# EAGLE design rgbshade-monocle-r1 (EAGLE 5.12)
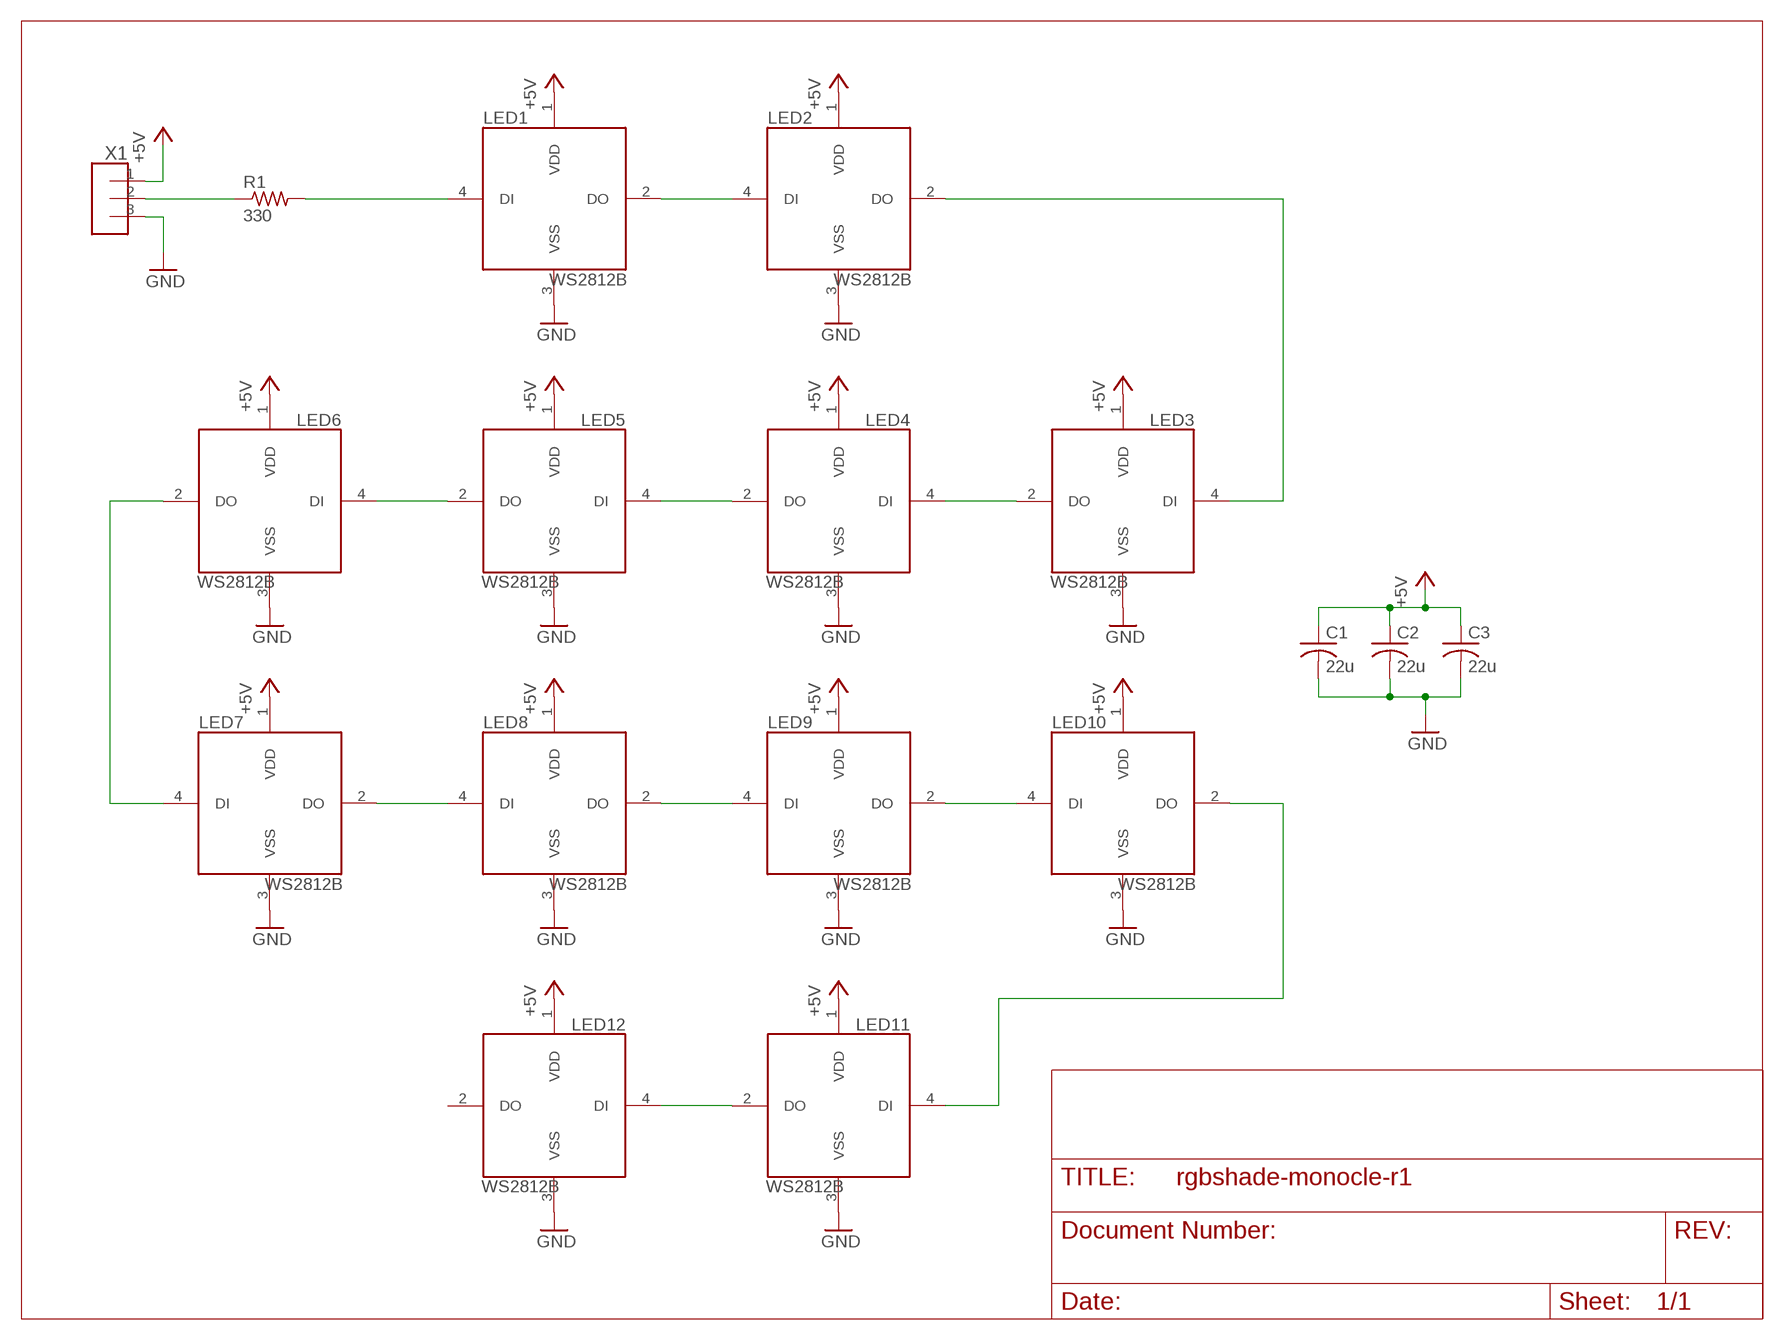
[diagram p0: schematic, sheet 1]

## Parts
C1  22u  C-USC1206  [C1206]
C2  22u  C-USC1206  [C1206]
C3  22u  C-USC1206  [C1206]
LED1  WS2812B  [LED-TRICOLOR-5050-4PIN]
LED2  WS2812B  [LED-TRICOLOR-5050-4PIN]
LED3  WS2812B  [LED-TRICOLOR-5050-4PIN]
LED4  WS2812B  [LED-TRICOLOR-5050-4PIN]
LED5  WS2812B  [LED-TRICOLOR-5050-4PIN]
LED6  WS2812B  [LED-TRICOLOR-5050-4PIN]
LED7  WS2812B  [LED-TRICOLOR-5050-4PIN]
LED8  WS2812B  [LED-TRICOLOR-5050-4PIN]
LED9  WS2812B  [LED-TRICOLOR-5050-4PIN]
LED10  WS2812B  [LED-TRICOLOR-5050-4PIN]
LED11  WS2812B  [LED-TRICOLOR-5050-4PIN]
LED12  WS2812B  [LED-TRICOLOR-5050-4PIN]
R1  330  R-US_R0603  [R0603]
X1  M03-100MIL  [100MIL-3]

## Nets
+5V: C1.1 C2.1 C3.1 LED1.1(VDD) LED2.1(VDD) LED3.1(VDD) LED4.1(VDD) LED5.1(VDD) LED6.1(VDD) LED7.1(VDD) LED8.1(VDD) LED9.1(VDD) LED10.1(VDD) LED11.1(VDD) LED12.1(VDD) X1.1
GND: C1.2 C2.2 C3.2 LED1.3(VSS) LED2.3(VSS) LED3.3(VSS) LED4.3(VSS) LED5.3(VSS) LED6.3(VSS) LED7.3(VSS) LED8.3(VSS) LED9.3(VSS) LED10.3(VSS) LED11.3(VSS) LED12.3(VSS) X1.3
N$1: LED1.2(DO) LED2.4(DI)
N$2: LED2.2(DO) LED3.4(DI)
N$3: LED3.2(DO) LED4.4(DI)
N$4: LED4.2(DO) LED5.4(DI)
N$5: LED5.2(DO) LED6.4(DI)
N$6: LED6.2(DO) LED7.4(DI)
N$7: LED7.2(DO) LED8.4(DI)
N$8: LED8.2(DO) LED9.4(DI)
N$9: LED9.2(DO) LED10.4(DI)
N$10: LED10.2(DO) LED11.4(DI)
N$11: LED11.2(DO) LED12.4(DI)
N$12: LED1.4(DI) R1.2
N$13: R1.1 X1.2
Unconnected: LED12.2(DO)

## Library data of the parts
C1-C3 = rcl:C-US: CAPACITOR, American symbol
LED1-LED12 = rbg-worldsemi-led:WS2812B
R1 = rcl:R-US_: RESISTOR, American symbol
X1 = rbg-generic-headers:M03-100MIL

## Board
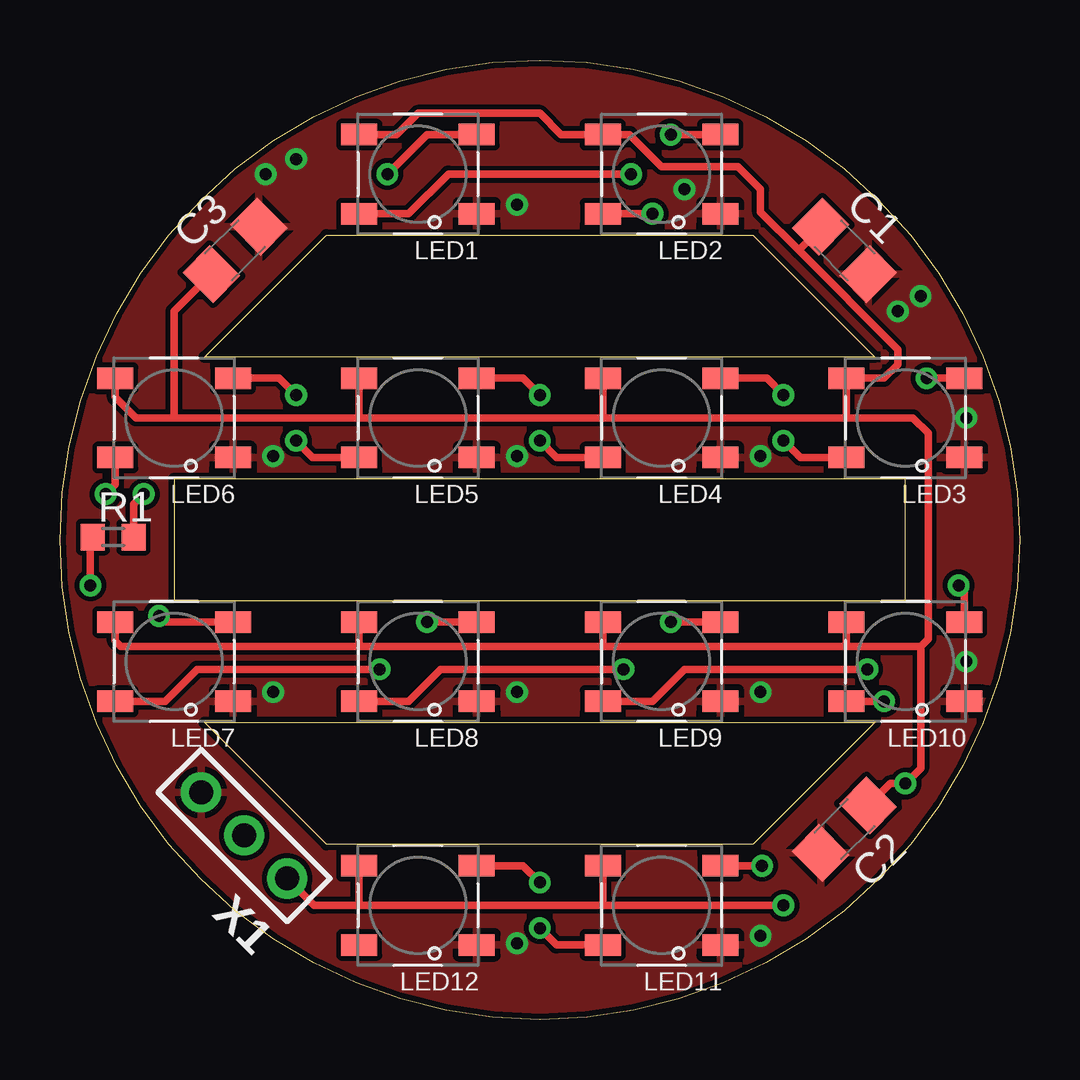
[diagram p1: board, top side]
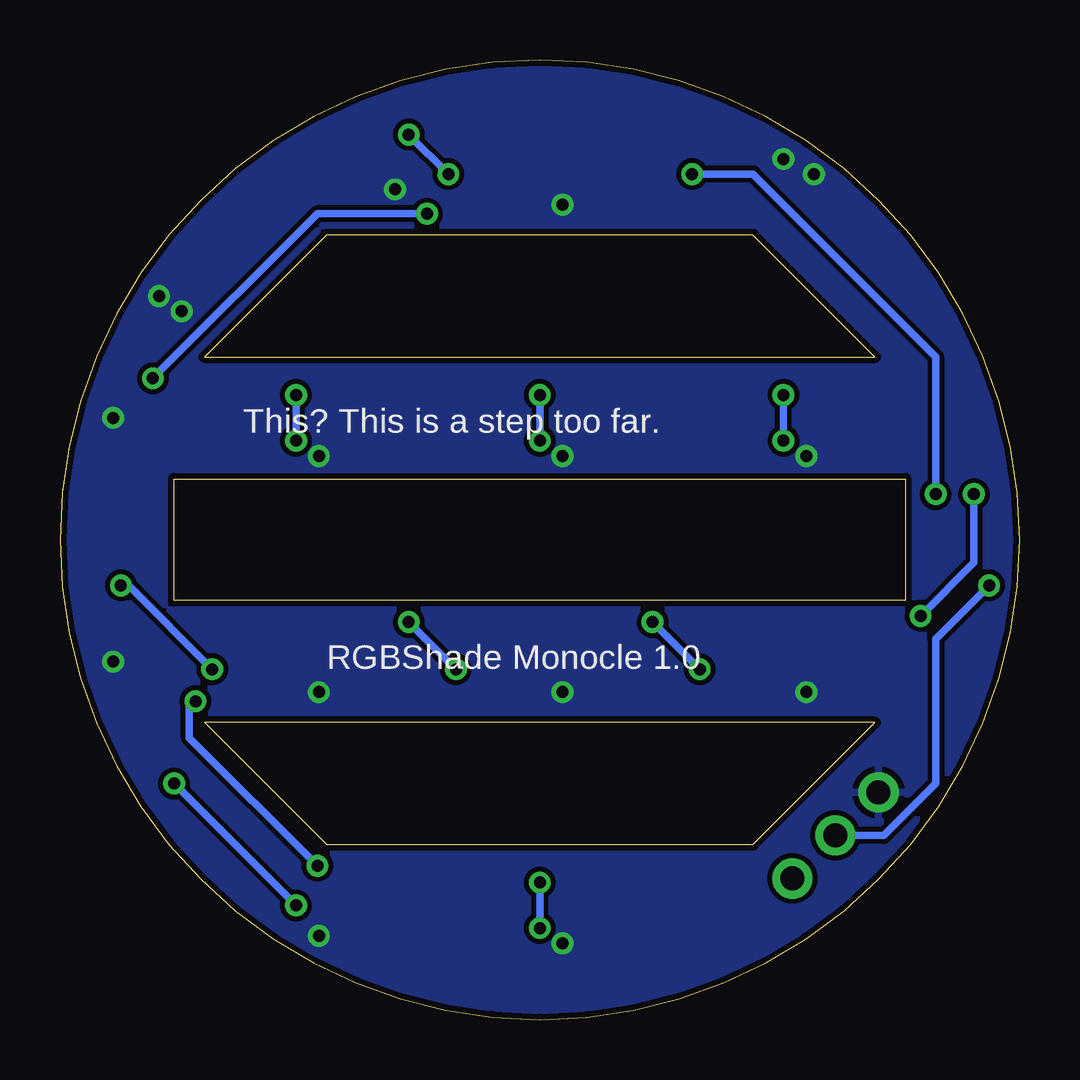
[diagram p2: board, bottom side, seen from below]

Size 40 x 40 mm. Coordinates in mm from the lower left corner, seen from the top.
Outline: 0,20 arc-180 40,20 arc-180 0,20
Outline: 6.03,12.38 33.97,12.38 28.89,7.3 11.11,7.3 6.03,12.38
Outline: 4.76,17.46 35.24,17.46 35.24,22.54 4.76,22.54 4.76,17.46
Outline: 11.11,32.7 28.89,32.7 33.97,27.62 6.03,27.62 11.11,32.7
Copper layers (1*16): Top 0.035mm / dielectric 1.5mm / Bottom 0.035mm
Design rules "default *": minimum track width 10mil, minimum drill 0.5mm, track to track 8mil, track to pad 8mil, pad to pad 8mil, via to via 8mil, smd to smd 8mil, copper to edge 10mil, drill to drill 8mil, minimum pad ring 10mil, minimum via ring 8mil, stop-mask expansion 4mil, vias tented up to drill 20mil, thermal gap 10mil

### Footprints (pad centres in the part's own frame; a part is rotated, then mirrored left to right if it is on the bottom)
C1206 = smd 1.6 x 1.8: 1 -1.4,0; 2 1.4,0
LED-TRICOLOR-5050-4PIN = smd 1.5 x 0.9: 1 2.45,-1.65; 2 2.45,1.65; 3 -2.45,1.65; 4 -2.45,-1.65
R0603 = smd 1 x 1.1: 1 -0.85,0; 2 0.85,0
100MIL-3 = drill 1 pad 1.676 round: 1 -2.54,0; 2 0,0; 3 2.54,0

### Placement (x,y rotation side)
C1  32.7,32.06 315 top
C2  32.7,7.94 225 top
C3  7.3,32.06 45 top
LED1  14.92,35.24 180 top
LED2  25.08,35.24 180 top
LED3  35.24,25.08 180 top
LED4  25.08,25.08 180 top
LED5  14.92,25.08 180 top
LED6  4.76,25.08 180 top
LED7  4.76,14.92 180 top
LED8  14.92,14.92 180 top
LED9  25.08,14.92 180 top
LED10  35.24,14.92 180 top
LED11  25.08,4.76 180 top
LED12  14.92,4.76 180 top
R1  2.22,20.11 0 top
X1  7.67,7.67 135 top

### Tracks (layer width: path | path; a pad name or v marks a point on that pad's centre or on a via)
+5V  (via drill 0.5)
  Top 0.305: 30.8,32.06 34.92,27.94 34.92,27.3 34.35,26.73 LED3.1 32.79,25.17 32.7,25.08 | 30.8,32.06 29.21,33.65 29.21,34.61 28.26,35.56 25.08,35.56 23.75,36.89 LED2.1 20.89,36.89 20,37.78 14.92,37.78 14.03,36.89 LED1.1 | 12.38,25.08 4.76,25.08 | 4.76,25.08 3.17,25.08 2.31,25.94 LED6.1 | 22.54,25.08 12.38,25.08 | LED5.1 12.47,25.17 12.38,25.08 | LED4.1 22.63,25.17 22.54,25.08 | C3.1 4.76,29.52 4.76,25.08 | LED7.1 2.31,15.78 2.54,15.55 12.38,15.55 | 32.7,15.55 35.88,15.55 | 22.54,15.55 32.7,15.55 | 22.54,15.55 12.38,15.55 | LED10.1 32.79,15.64 32.7,15.55 | LED9.1 22.63,15.64 22.54,15.55 | LED8.1 12.47,15.64 12.38,15.55 | 32.7,25.08 35.56,25.08 36.19,24.45 36.19,15.87 35.88,15.55 | 32.7,25.08 22.54,25.08 | LED12.1 12.47,4.85 12.38,4.76 | v30.16,4.76 22.54,4.76 | 22.54,4.76 12.38,4.76 | LED11.1 22.63,4.85 22.54,4.76 | 33.69,8.29 C2.1 34.61,9.84 v35.24,9.84 35.88,10.47 35.88,15.55 | X1.1 10.58,4.76 12.38,4.76 | C1.1 31.71,32.98 30.8,32.06
  Bottom 0.305: v35.24,9.84 | v35.24,9.84 v30.16,4.76
GND  (via drill 0.5)
  other vias: 19.05,23.49 29.21,23.49 8.89,23.49 19.05,33.97 26.03,34.61 19.05,13.65 8.89,13.65 29.21,13.65 19.05,3.17 29.21,3.49 37.78,25.08 37.78,14.92 35.88,30.16 34.92,29.52 8.57,35.24 9.84,35.88
  pour Top: -0.32,40.32 40.32,40.32 40.32,-0.32 -0.32,-0.32
  pour Bottom: -0.32,40.32 40.32,40.32 40.32,-0.32 -0.32,-0.32
N$1  (via drill 0.5)
  Top 0.305: LED1.2 14.54,33.59 16.19,35.24 v23.81,35.24 | v25.46,36.89 LED2.4
  Bottom 0.305: v23.81,35.24 v25.46,36.89
N$2  (via drill 0.5)
  Top 0.305: LED2.2 v24.7,33.59 | v36.13,26.73 LED3.4
  Bottom 0.305: v24.7,33.59 29.27,33.59 v36.13,26.73
N$3  (via drill 0.5)
  Top 0.305: LED4.4 29.46,26.73 v30.16,26.03 | LED3.2 30.86,23.43 v30.16,24.13
  Bottom 0.305: v30.16,26.03 v30.16,24.13
N$4  (via drill 0.5)
  Top 0.305: LED5.4 19.3,26.73 v20,26.03 | LED4.2 20.7,23.43 v20,24.13
  Bottom 0.305: v20,26.03 v20,24.13
N$5  (via drill 0.5)
  Top 0.305: LED6.4 9.14,26.73 v9.84,26.03 | LED5.2 10.54,23.43 v9.84,24.13
  Bottom 0.305: v9.84,24.13 v9.84,26.03
N$6  (via drill 0.5)
  Top 0.305: LED6.2 2.31,22.31 v1.9,21.91 | LED7.4 4.38,16.57 v4.12,16.82
  Bottom 0.305: v1.9,21.91 1.9,19.05 v4.12,16.82
N$7  (via drill 0.5)
  Top 0.305: LED7.2 4.38,13.27 5.71,14.6 v13.33,14.6 | LED8.4 v15.3,16.57
  Bottom 0.305: v15.3,16.57 v13.33,14.6
N$8  (via drill 0.5)
  Top 0.305: LED8.2 14.54,13.27 15.87,14.6 v23.49,14.6 | LED9.4 v25.46,16.57
  Bottom 0.305: v25.46,16.57 v23.49,14.6
N$9  (via drill 0.5)
  Top 0.305: LED9.2 24.7,13.27 26.03,14.6 v33.65,14.6 | LED10.4 37.69,17.87 v37.46,18.09
  Bottom 0.305: v37.46,18.09 37.14,18.09 v33.65,14.6
N$10  (via drill 0.5)
  Top 0.305: v34.35,13.27 LED10.2 | v29.27,6.41 LED11.4
  Bottom 0.305: v34.35,13.27 34.61,13.02 34.61,11.74 v29.27,6.41
N$11  (via drill 0.5)
  Top 0.305: LED12.4 19.3,6.41 v20,5.71 | LED11.2 20.7,3.11 v20,3.81
  Bottom 0.305: v20,3.81 v20,5.71
N$12  (via drill 0.5)
  Top 0.305: LED1.4 15.3,36.89 v13.65,35.24 | R1.2 3.07,21.48 v3.49,21.91
  Bottom 0.305: v3.49,21.91 3.49,27.62 11.11,35.24 v13.65,35.24
N$13  (via drill 0.5)
  Top 0.305: v1.27,18.09 1.27,20.01 R1.1
  Bottom 0.305: X1.2 5.66,7.67 3.49,9.84 3.49,15.87 v1.27,18.09

### Text on the board
bNames: This? This is a step too far. | RGBShade Monocle 1.0